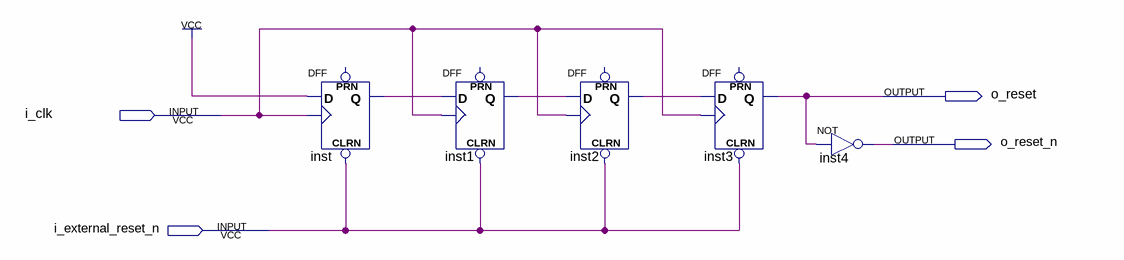
[diagram p0: schematic sheet]
// Quartus schematic reset_sync.bdf as structural Verilog: 5 symbols, 4 pins
module reset_sync (
  input  i_clk,
  input  i_external_reset_n,
  output o_reset,
  output o_reset_n
);

  wire inst1_q, inst2_q, inst_q;

  DFF inst (.CLRN(i_external_reset_n), .CLK(i_clk), .D(1'b1), .Q(inst_q));  // open: PRN
  DFF inst1 (.CLRN(i_external_reset_n), .CLK(i_clk), .D(inst_q), .Q(inst1_q));  // open: PRN
  DFF inst2 (.CLRN(i_external_reset_n), .CLK(i_clk), .D(inst1_q), .Q(inst2_q));  // open: PRN
  DFF inst3 (.CLRN(i_external_reset_n), .CLK(i_clk), .D(inst2_q), .Q(o_reset));  // open: PRN
  not inst4 (o_reset_n, o_reset);
endmodule
